# Altium project EBS_DigitalBoard.PrjPcb
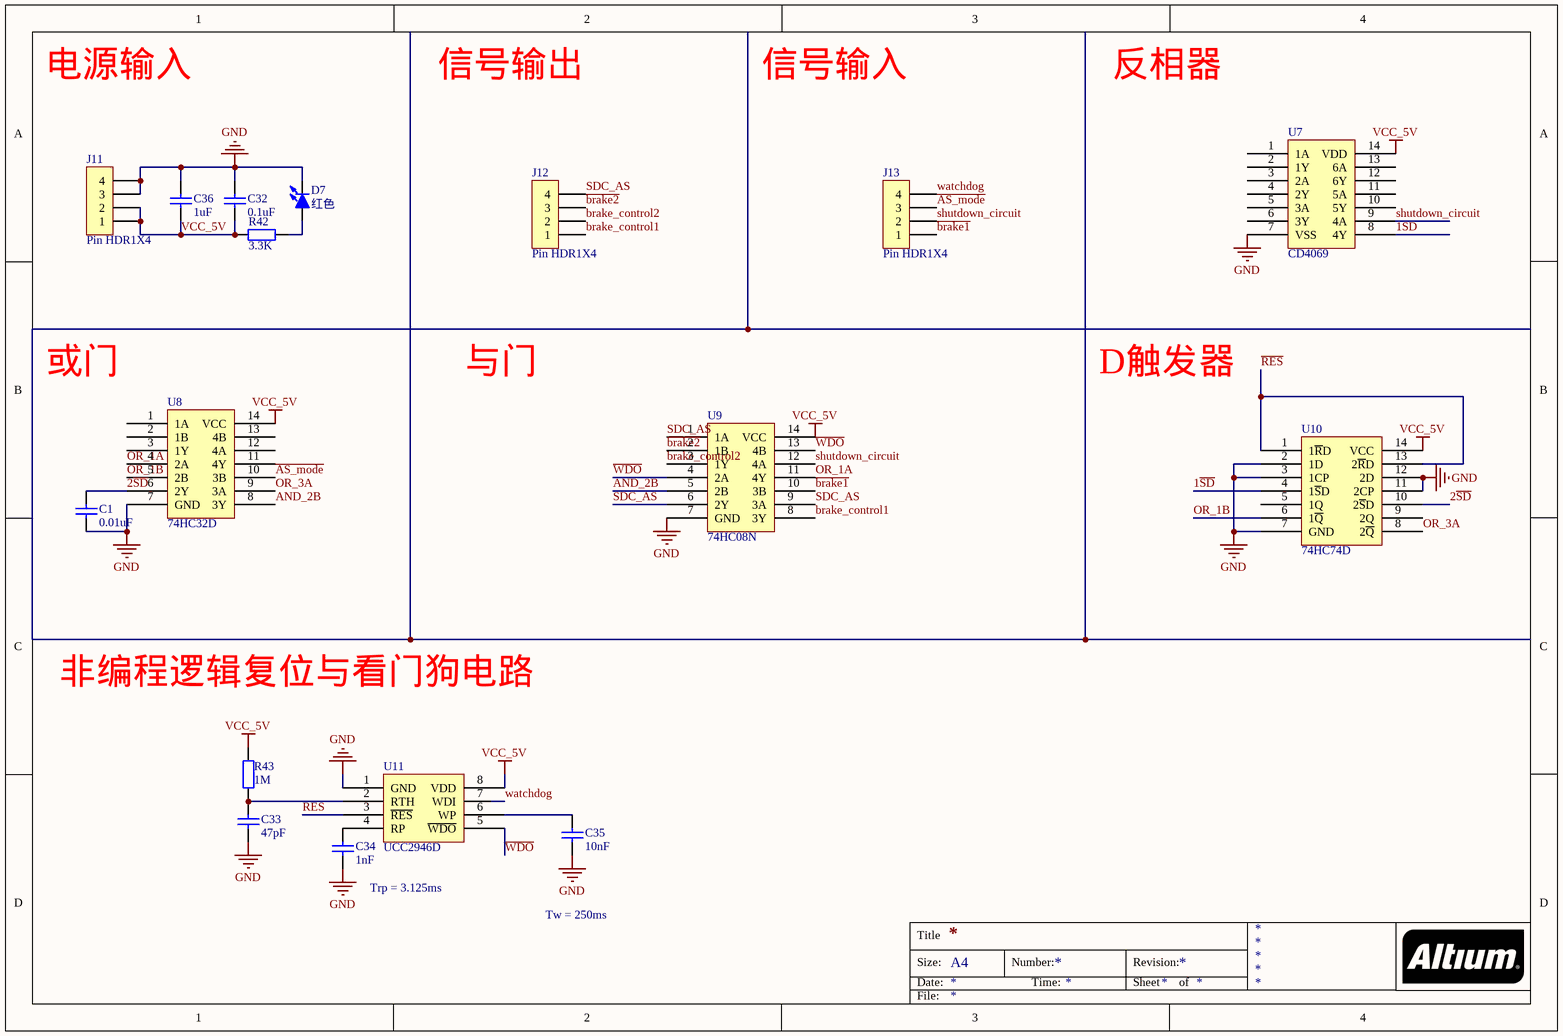
[diagram p0: HRT_23D_EBS_Non1.1.SchDoc]
1 sheet, 17 parts. Net scope: global (net labels, ports and power ports of the same name join across sheets).
Board file: HRT_23D_EBS_Non1.1.PcbDoc

## Sheet HRT_23D_EBS_Non1.1.SchDoc
size A4

### Parts
C1  0.01uF  [C 0805_M]
C32  0.1uF  [C 0805_M]
C33  47pF  [C 0805_M]
C34  1nF  [C 0805_M]
C35  10nF  [C 0805_M]
C36  1uF  [C 0805_M]
D7  红色  [LED 0805G]
J11  Pin HDR1X4  [Pin HDR1X4/2.54mm-S]
J12  Pin HDR1X4  [Pin HDR1X4/2.54mm-S]
J13  Pin HDR1X4  [Pin HDR1X4/2.54mm-S]
R42  3.3K  [0805R]
R43  1M  [0805R]
U7  CD4069  [SOP14]
U8  74HC32D  [SOP14]
U9  74HC08N  [SOP14]
U10  74HC74D  [SOP14]
U11  UCC2946D  [SOP8]

### Nets
GND: C1.1 C32.2 C33.1 C34.1 C35.1 C36.2 D7.2(K) J11.3 J11.4 U7.7(VSS) U8.7(GND) U9.7(GND) U10.2(1D) U10.3(1CP) U10.7(GND) U10.11(2CP) U10.12(2D) U11.1(GND)
VCC_5V: C32.1 C36.1 J11.1 J11.2 R42.1 R43.2 U7.14(VDD) U8.14(VCC) U9.14(VCC) U10.14(VCC) U11.8(VDD)
1~{SD}: U7.8(4Y) U10.4(1~{S}D)
2~{SD}: C1.2 U8.6(2Y) U10.10(2~{S}D)
~{AS_mode}: J13.3 U8.10(3B)
AND_2B: U8.8(3Y) U9.5(2B)
~{brake1}: J13.1 U9.10(3B)
~{brake2}: J12.3 U9.2(1B)
brake_control1: J12.1 U9.8(3Y)
brake_control2: J12.2 U9.3(1Y)
OR_1A: U8.4(2A) U9.11(4Y)
OR_1B: U8.5(2B) U10.6(1~{Q})
OR_3A: U8.9(3A) U10.8(2~{Q})
~{RES}: U10.1(1~{R}D) U10.13(2~{R}D) U11.3(~{RES})
SDC_AS: J12.4 U9.1(1A) U9.6(2Y) U9.9(3A)
shutdown_circuit: J13.2 U7.9(4A) U9.12(4A)
~{WDO}: U9.4(2A) U9.13(4B) U11.5(~{WDO})
watchdog: J13.4 U11.7(WDI)
NetC33_2: C33.2 R43.1 U11.2(RTH)
NetC34_2: C34.2 U11.4(RP)
NetC35_2: C35.2 U11.6(WP)
NetD7_1: D7.1(A) R42.2

Not connected (* = marked no-connect by the designer): U7 1(1A) 2(1Y) 3(2A) 4(2Y) 5(3A) 6(3Y) 10(5Y) 11(5A) 12(6Y) 13(6A); U8 1(1A) 2(1B) 3(1Y) 11(4Y) 12(4A) 13(4B); U10 5(1Q) 9(2Q)

### Notes on the sheet
- 电源输入
- 信号输出
- 信号输入
- 反相器
- 或门
- 与门
- D触发器
- 非编程逻辑复位与看门狗电路
- Trp = 3.125ms
- Tw = 250ms
- Title
- Size:
- Date:
- A4
- Number:
- Time:
- Revision:
- Sheet
- of
- File:

### Library data of the parts
C1 C32-C36 = C: 无极性贴片电容
D7 = LED-SMD: 贴片LED; 版权归属: 源创客; BOM名称: 贴片LED; 学习资源: www.ooocke.com
R42 R43 = RES: 贴片电阻
U7 = CD4069: 反相器
U8 = 74HC32D: 2输入或门
U9 = 74HC08N: 2输入与门
U10 = 74HC74D: D触发器
U11 = UCC2946D: 复位监控芯片